# Altium schematic sheet WX0.007.002DL.SchDoc
size A2
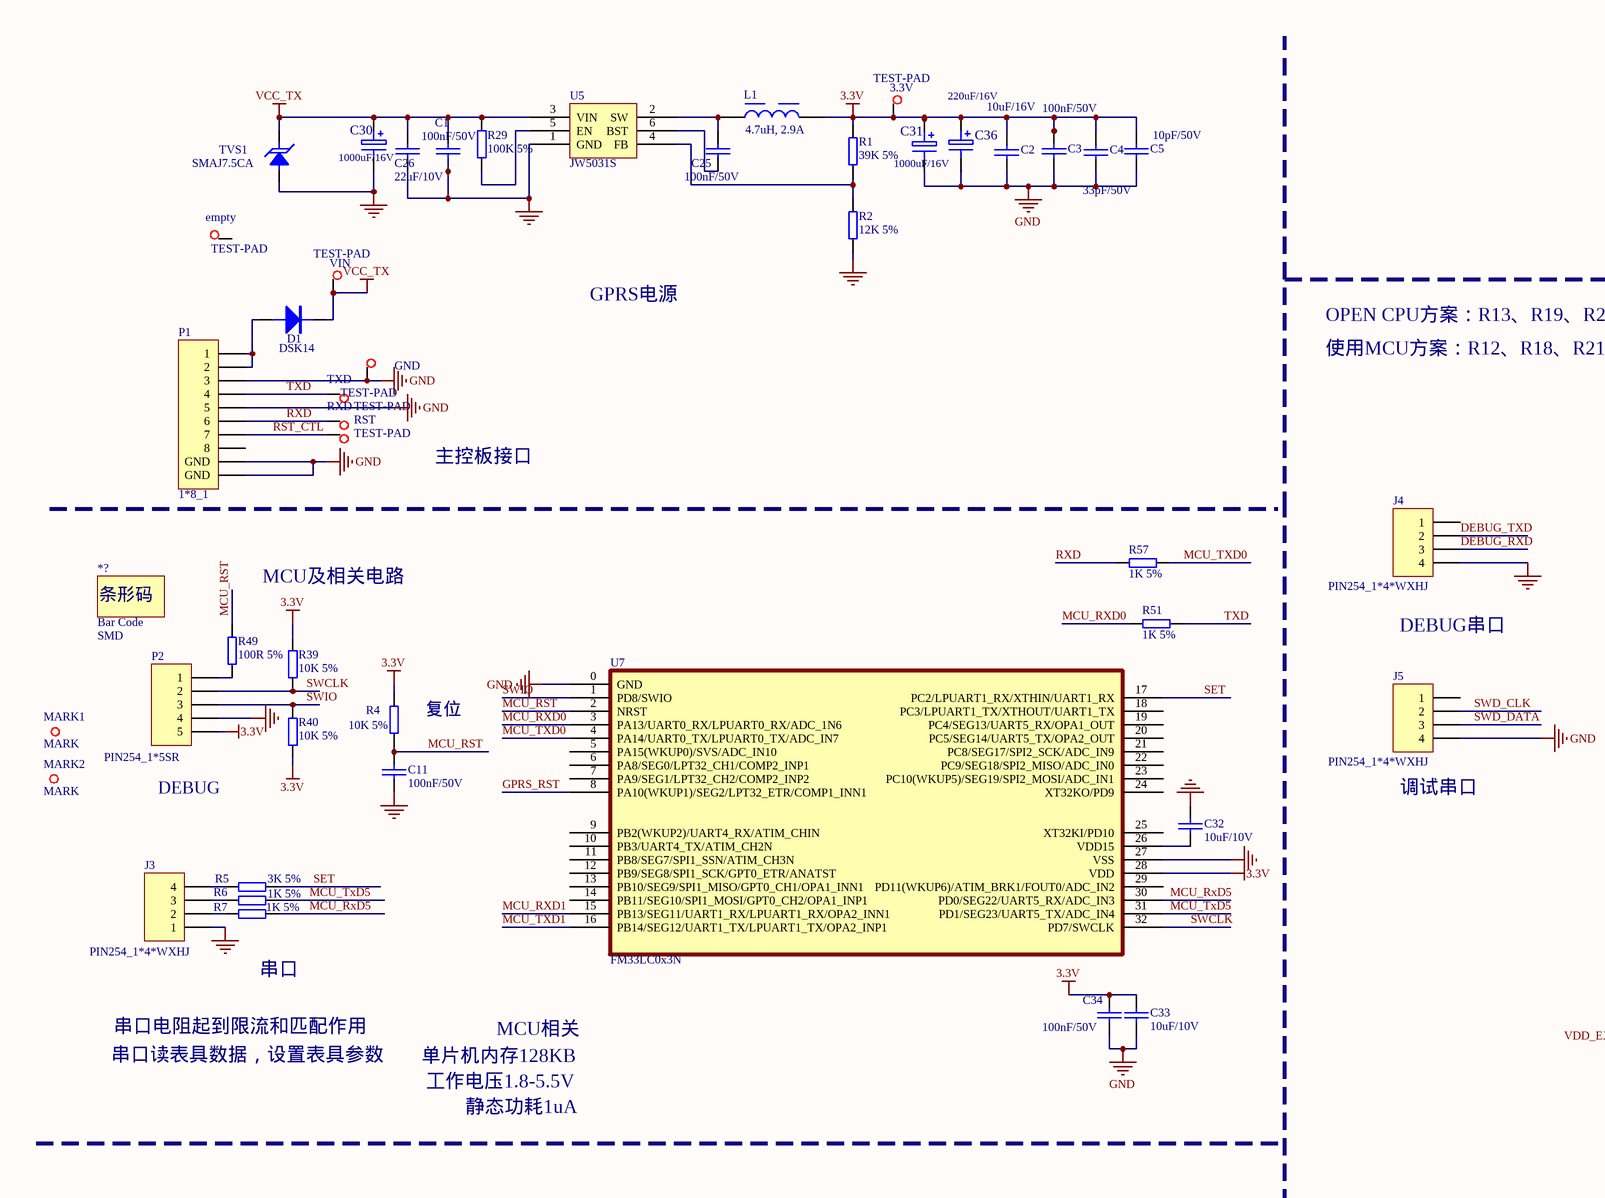
[diagram p0: WX0.007.002DL.SchDoc, left]
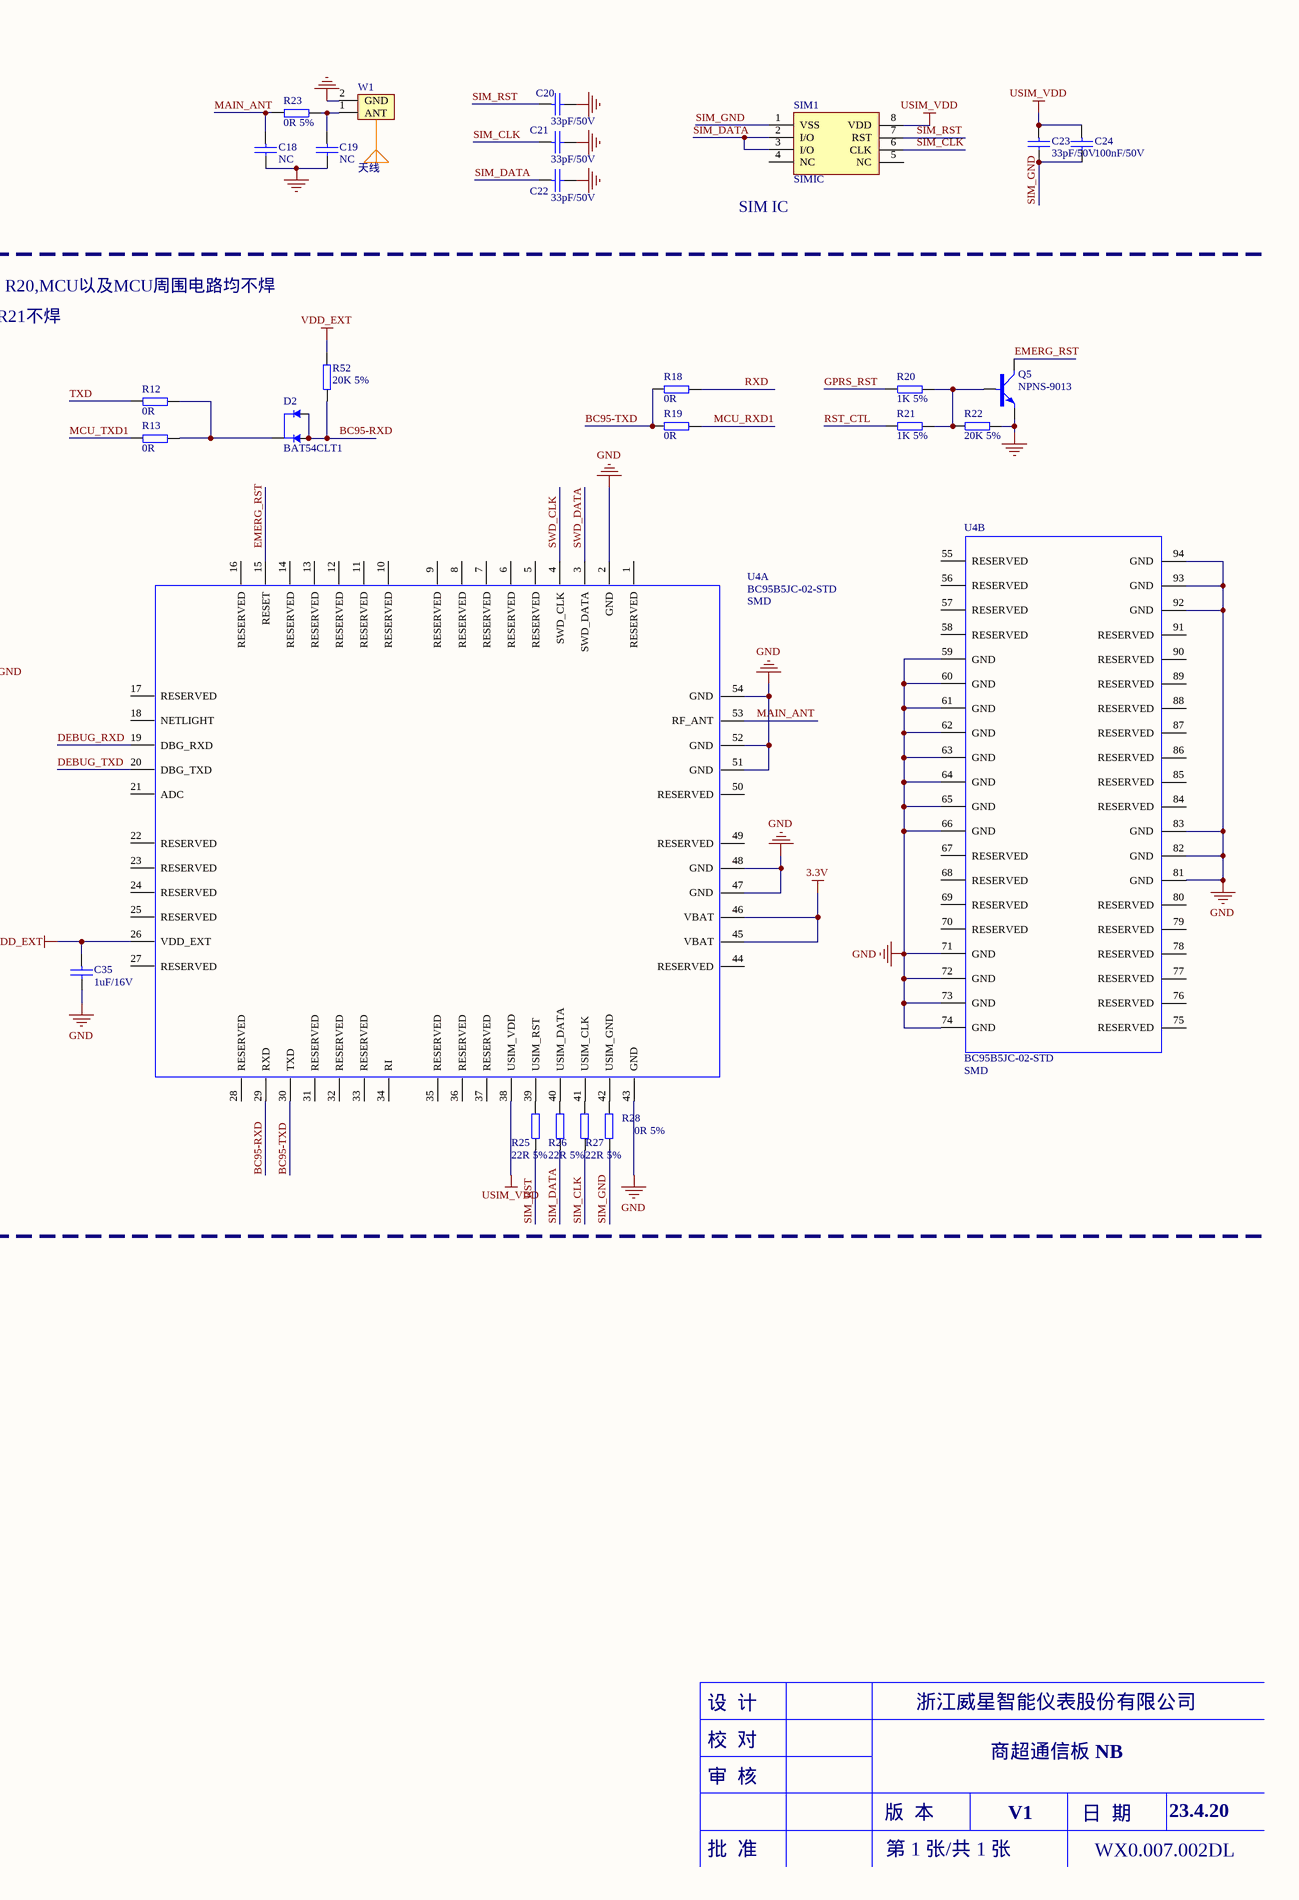
[diagram p1: WX0.007.002DL.SchDoc, right]

## Parts
3.3V  TEST-PAD  [TEST-PAD]
*?  Bar Code  SMD/DIP: SMD  [Bar Code1]
C1  100nF/50V  [CAP0603]
C2  10uF/16V  [CAP1206]
C3  100nF/50V  [CAP0603]
C4  33pF/50V  [CAP0603]
C5  10pF/50V  [CAP0603]
C11  100nF/50V  [CAP0603]
C18  NC  [CAP0603]
C19  NC  [CAP0603]
C20  33pF/50V  [CAP0603]
C21  33pF/50V  [CAP0603]
C22  33pF/50V  [CAP0603]
C23  33pF/50V  [CAP0603]
C24  100nF/50V  [CAP0603]
C25  100nF/50V  [CAP0603]
C26  22uF/10V  [CAP0805]
C30  1000uF/16V  [CAPSM_450_1000_1050]
C31  1000uF/16V  [CAPSM_450_1000_1050]
C32  10uF/10V  [CAP0603]
C33  10uF/10V  [CAP0603]
C34  100nF/50V  [CAP0603]
C35  1uF/16V  [CAP0603]
C36  220uF/16V  [220uf]
D1  DSK14  [SOD-123FL]
D2  BAT54CLT1  [SOT-23]
empty  TEST-PAD  [TEST-PAD]
GND  GND  [TEST-PAD]  (value not drawn)
J3  PIN254_1*4*WXHJ  [PIN254_1*4*1100S]
J4  PIN254_1*4*WXHJ  [PIN254_1*4*1100S]
J5  PIN254_1*4*WXHJ  [PIN254_1*4*1100S]
L1  4.7uH, 2.9A  [WE-MAPI_4020]
MARK1  MARK  [MARK]
MARK2  MARK  [MARK]
P1  1*8_1  [A2502AWR 1*8]
P2  PIN254_1*5SR  [PIN254_1*5SR]
Q5  NPNS-9013  [SOT-23]
R1  39K 5%  [RES0603]
R2  12K 5%  [RES0603]
R4  10K 5%  [RES0603]
R5  3K 5%  [RES0603]
R6  1K 5%  [RES0603]
R7  1K 5%  [RES0603]
R12  0R  [RES0603]
R13  0R  [RES0603]
R18  0R  [RES0603]
R19  0R  [RES0603]
R20  1K 5%  [RES0603]
R21  1K 5%  [RES0603]
R22  20K 5%  [RES0603]
R23  0R 5%  [RES0603]
R25  22R 5%  [RES0603]
R26  22R 5%  [RES0603]
R27  22R 5%  [RES0603]
R28  0R 5%  [RES0603]
R29  100K 5%  [RES0603]
R39  10K 5%  [RES0603]
R40  10K 5%  [RES0603]
R49  100R 5%  [RES0603]
R51  1K 5%  [RES0603]
R52  20K 5%  [RES0603]
R57  1K 5%  [RES0603]
RST  TEST-PAD  [TEST-PAD]
RXD  TEST-PAD  [TEST-PAD]
SIM1  SIMIC  [SIMIC]
TVS1  SMAJ7.5CA  [SMAJ7.5A]
TXD  TEST-PAD  [TEST-PAD]
U4  BC95B5JC-02-STD  SMD/DIP: SMD  [BC95B5JC-02-STD]  (parts A,B of 2)
U5  JW5031S  [PCBComponent_1 - duplicate1]
U7  FM33LC0x3N  [QFN32]
VIN  TEST-PAD  [TEST-PAD]
W1  天线  [ANT-IPEX]

## Nets
3.3V: 3.3V.1 C2.1 C3.1 C4.1 C5.1 C31.1 C33.1 C34.1 C36.1 L1.2 P2.5 R1.2 R4.2 R39.1 R40.1 U4.45(VBAT) U4.46(VBAT) U7.28(VDD)
GND: C1.1 C2.2 C3.2 C4.2 C5.2 C11.2 C18.2 C19.2 C20.2 C21.2 C22.2 C26.2 C30.2 C31.2 C32.1 C33.2 C34.2 C35.2 C36.2 GND.1 J3.1 J4.4 J5.4 P1.3 P1.5 P1.9(GND) P1.10(GND) P2.4 Q5.2(E) R2.1 R22.2 TVS1.2 U4.2(GND) U4.43(GND) U4.47(GND) U4.48(GND) U4.51(GND) U4.52(GND) U4.54(GND) U4.59(GND) U4.60(GND) U4.61(GND) U4.62(GND) U4.63(GND) U4.64(GND) U4.65(GND) U4.66(GND) U4.71(GND) U4.72(GND) U4.73(GND) U4.74(GND) U4.81(GND) U4.82(GND) U4.83(GND) U4.92(GND) U4.93(GND) U4.94(GND) U5.1(GND) U7.0(GND) U7.27(VSS) W1.2(GND)
USIM_VDD: C23.1 C24.1 SIM1.8(VDD) U4.38(USIM_VDD)
VCC_TX: C1.2 C26.1 C30.1 D1.2(K) R29.2 TVS1.1 U5.3(VIN) VIN.1
VDD_EXT: C35.1 R52.2 U4.26(VDD_EXT)
BC95-RXD: D2.1(A) D2.2(A) R52.1 U4.29(RXD)
BC95-TXD: R18.1 R19.1 U4.30(TXD)
DEBUG_RXD: J4.3 U4.19(DBG_RXD)
DEBUG_TXD: J4.2 U4.20(DBG_TXD)
EMERG_RST: Q5.3(C) U4.15(RESET)
GPRS_RST: R20.1 U7.8(PA10(WKUP1)/SEG2/LPT32_ETR/COMP1_INN1)
MAIN_ANT: C18.1 R23.1 U4.53(RF_ANT)
MCU_RST: C11.1 R4.1 R49.1 U7.2(NRST)
MCU_RXD0: R51.1 U7.3(PA13/UART0_RX/LPUART0_RX/ADC_1N6)
MCU_RXD1: R19.2 U7.15(PB13/SEG11/UART1_RX/LPUART1_RX/OPA2_INN1)
MCU_RxD5: R7.2 U7.30(PD0/SEG22/UART5_RX/ADC_IN3)
MCU_TXD0: R57.2 U7.4(PA14/UART0_TX/LPUART0_TX/ADC_IN7)
MCU_TXD1: R13.1 U7.16(PB14/SEG12/UART1_TX/LPUART1_TX/OPA2_INP1)
MCU_TxD5: R6.2 U7.31(PD1/SEG23/UART5_TX/ADC_IN4)
RST_CTL: P1.7 R21.1 RST.1
RXD: P1.6 R18.2 R57.1 RXD.1
SET: R5.2 U7.17(PC2/LPUART1_RX/XTHIN/UART1_RX)
SIM_CLK: C21.1 R27.1 SIM1.6(CLK)
SIM_DATA: C22.1 R26.1 SIM1.2(I/O) SIM1.3(I/O)
SIM_GND: C23.2 C24.2 R28.1 SIM1.1(VSS)
SIM_RST: C20.1 R25.1 SIM1.7(RST)
SWCLK: P2.2 R39.2 U7.32(PD7/SWCLK)
SWD_CLK: J5.2 U4.4(SWD_CLK)
SWD_DATA: J5.3 U4.3(SWD_DATA)
SWIO: P2.3 R40.2 U7.1(PD8/SWIO)
TXD: P1.4 R12.1 R51.2 TXD.1
NetC19_1: C19.1 R23.2 W1.1(ANT)
NetC25_1: C25.1 L1.1 U5.2(SW)
NetC25_2: C25.2 U5.6(BST)
NetC32_2: C32.2 U7.26(VDD15)
NetD1_1: D1.1(A) P1.1 P1.2
NetD2_3: D2.3(C) R12.2 R13.2
NetJ3_2: J3.2 R7.1
NetJ3_3: J3.3 R6.1
NetJ3_4: J3.4 R5.1
NetP2_1: P2.1 R49.2
NetQ5_1: Q5.1(B) R20.2 R21.2 R22.1
NetR1_1: R1.1 R2.2 U5.4(FB)
NetR25_2: R25.2 U4.39(USIM_RST)
NetR26_2: R26.2 U4.40(USIM_DATA)
NetR27_2: R27.2 U4.41(USIM_CLK)
NetR28_2: R28.2 U4.42(USIM_GND)
NetR29_1: R29.1 U5.5(EN)

Not connected (* = marked no-connect by the designer): empty 1; J4 1; J5 1; P1 8; SIM1 4(NC) 5(NC); U4 1(RESERVED) 5(RESERVED) 6(RESERVED) 7(RESERVED) 8(RESERVED) 9(RESERVED) 10(RESERVED) 11(RESERVED) 12(RESERVED) 13(RESERVED) 14(RESERVED) 16(RESERVED) 17(RESERVED) 18(NETLIGHT) 21(ADC) 22(RESERVED) 23(RESERVED) 24(RESERVED) 25(RESERVED) 27(RESERVED) 28(RESERVED) 31(RESERVED) 32(RESERVED) 33(RESERVED) 34(RI) 35(RESERVED) 36(RESERVED) 37(RESERVED) 44(RESERVED) 49(RESERVED) 50(RESERVED) 55(RESERVED) 56(RESERVED) 57(RESERVED) 58(RESERVED) 67(RESERVED) 68(RESERVED) 69(RESERVED) 70(RESERVED) 75(RESERVED) 76(RESERVED) 77(RESERVED) 78(RESERVED) 79(RESERVED) 80(RESERVED) 84(RESERVED) 85(RESERVED) 86(RESERVED) 87(RESERVED) 88(RESERVED) 89(RESERVED) 90(RESERVED) 91(RESERVED); U7 5(PA15(WKUP0)/SVS/ADC_IN10) 6(PA8/SEG0/LPT32_CH1/COMP2_INP1) 7(PA9/SEG1/LPT32_CH2/COMP2_INP2) 9(PB2(WKUP2)/UART4_RX/ATIM_CHIN) 10(PB3/UART4_TX/ATIM_CH2N) 11(PB8/SEG7/SPI1_SSN/ATIM_CH3N) 12(PB9/SEG8/SPI1_SCK/GPT0_ETR/ANATST) 13(PB10/SEG9/SPI1_MISO/GPT0_CH1/OPA1_INN1) 14(PB11/SEG10/SPI1_MOSI/GPT0_CH2/OPA1_INP1) 18(PC3/LPUART1_TX/XTHOUT/UART1_TX) 19(PC4/SEG13/UART5_RX/OPA1_OUT) 20(PC5/SEG14/UART5_TX/OPA2_OUT) 21(PC8/SEG17/SPI2_SCK/ADC_IN9) 22(PC9/SEG18/SPI2_MISO/ADC_IN0) 23(PC10(WKUP5)/SEG19/SPI2_MOSI/ADC_IN1) 24(XT32KO/PD9) 25(XT32KI/PD10) 29(PD11(WKUP6)/ATIM_BRK1/FOUT0/ADC_IN2)

## Notes on the sheet
- (near SIM1) SIM IC
- GPRS电源
- OPEN CPU方案：R13、R19、R20,MCU以及MCU周围电路均不焊
- 使用MCU方案：R12、R18、R21不焊
- 主控板接口
- MCU及相关电路
- DEBUG串口
- (near R4) 复位
- (near P2) DEBUG
- (near J5) 调试串口
- 串口
- 串口电阻起到限流和匹配作用
- 单片机内存128KB
- MCU相关
- 串口读表具数据，设置表具参数
- 工作电压1.8-5.5V
- 静态功耗1uA
- 设  计
- 校  对
- 浙江威星智能仪表股份有限公司
- 审  核
- 商超通信板 NB
- 批  准
- 版  本
- 第 1 张/共 1 张
- V1
- 日  期
- WX0.007.002DL
- 23.4.20

## Library data of the parts
3.3V empty GND RST RXD TXD VIN = AD_WXHJ_TEST-PAD_01: 单面焊盘测试点; Part Name: 测试点; ID: 23; SMD/DIP: SMD; Part Number: AD_WXHJ_TEST-PAD_01
*? = AD_WXHJ_Bar Code_01: 条形码 无需焊接器件; ID: 12; Part Number: AD_WXHJ_Bar Code_01; Part Name: 条形码
C1 C3 C11 C24 C25 C34 = 101020103-0021: 104pF,50 V,±10%,0603,国巨,CC0603KRX7R9BB104; Part Name: 0603贴片电容; ID: 3; SMD/DIP: SMD; Part Number: 101020103-0021
C2 = 101020101-0005: 106P,16 V,±10%,1206,国巨,CC1206KRNPO7BN106P; Part Name: 1206贴片电容; ID: 9; SMD/DIP: SMD; Part Number: 101020101-0005
C4 C20-C23 = 101020103-0027: 33pF,50 V,±10%,0603,国巨,CC0603KRNPO9BN33; Part Name: 0603贴片电容; ID: 17; SMD/DIP: SMD; Part Number: 101020103-0027
C5 = 101020103-0014: 10pF,50 V,±5%,0603,X7R,国巨,CC0603JRNPO9BN100; Part Name: 0603贴片电容; ID: 7; SMD/DIP: SMD; Part Number: 101020103-0014
C18 C19 = CAP: 无极性电容
C26 = 101020102-0012: 226P,10 V,±20%,0805,村田电子有限公司,GRM21BR61A226ME51L; Part Name: 贴片电容; ID: 20; SMD/DIP: SMD; Part Number: 101020102-0012
C30 C31 C36 = CAP-POL1: 电解电容
C32 C33 = 101020103-0026: 106pF,10 V,±10%,0603,村田,GRM188R61A106KE47D; Part Name: 0603贴片电容; ID: 8; SMD/DIP: SMD; Part Number: 101020103-0026
C35 = 101020103-0003: 105pF,16 V,±10%,0603,国巨,CC0603KRX7R7BB105; Part Name: 0603贴片电容; ID: 14; SMD/DIP: SMD; Part Number: 101020103-0003
D1 = DIODE: 二极管，Diode
D2 = 101040101-0038: BAT54CLT1，SOT23-3,SOT23-3,0.2 A,0.8 V,30 V,安森美,BAT54CLT1; Part Name: 贴片肖特基; ID: 8; SMD/DIP: SMD; Part Number: 101040101-0038
J3-J5 = AD_WXHJ_PinHeader_01: 1*4 ，Φ1.0 ，2.54mm，直脚,无需焊接器件; Part Name: 排针; ID: 16; SMD/DIP: DIP; Part Number: AD_WXHJ_PinHeader_01
L1 = 74438356047: WE-MAPI SMT Power Inductor, size 4020, 4.7uH, 2.9A; Manufacturer: Wurth Elektronik; DC Resistance typ.: 63mOhm; DC Resistance max.: 76mOhm; Self Resonant Frequency: 22MHz; Saturation Current: 4.7A; ComponentLink1Description: Manufacturer; ComponentLink1URL: http://www.we-online.de; ComponentLink2Description: Datasheet; ComponentLink2URL: https://www.we-online.com/catalog/datasheet/74438356047.pdf; Mounting Technology: SMT; Operating Temperature: -40 to +125degC; Packaging: Tape and Reel; Published Date: December 2020; Size: 4020; Inductance: 4.7uH; Manufacturer Part Number: 74438356047; Rated Current: 2.9A
MARK1 MARK2 = AD_WXHJ_MARK_01: MARK点; ID: 8; SMD/DIP: SMD; Part Number: AD_WXHJ_MARK_01; Part Name: MARK点
P2 = 101090302-0002: 1*40 ，Φ1.0 ，2.54mm，弯脚,2.54 mm,单排,插件; Part Name: 排针; ID: 18; SMD/DIP: DIP; Part Number: 101090302-0002
Q5 = 101040201-0002: 9013,NPN,SOT-23,长电,S9013; Part Name: 贴片三极管; ID: 15; SMD/DIP: SMD; Part Number: 101040201-0002
R1 = 101010103-0064: 国巨,±5%,0603,,155 ℃,-55 ℃,RC0603JR-0739KL,无铅,100 ppm/℃,1/10W,,39K; Part Name: 0603贴片电阻; ID: 32; SMD/DIP: SMD; Part Number: 101010103-0064
R2 = 101010103-0046: 国巨,±5%,0603,,155 ℃,-55 ℃,RC0603JR-0712KL,含铅,100 ppm/℃,1/10W,,12K; Part Name: 0603贴片电阻; ID: 9; SMD/DIP: SMD; Part Number: 101010103-0046
R4 = 101010103-0003: 国巨,±5%,0603,,155 ℃,-55 ℃,RC0603JR-0710KL,无铅,200 ppm/℃,1/10W,,10K; Part Name: 0603贴片电阻; ID: 7; SMD/DIP: SMD; Part Number: 101010103-0003
R5 = 101010103-0006: 国巨,±5%,0603,,155 ℃,-55 ℃,RC0603JR-073KL,无铅,100 ppm/℃,1/10W,,3K; Part Name: 0603贴片电阻; ID: 22; SMD/DIP: SMD; Part Number: 101010103-0006
R6 R7 = 101010103-0008: 1K,±5%,1/10W,0603,国巨,RC0603JR-071KL; Part Name: 0603贴片电阻; ID: 9; SMD/DIP: SMD; Part Number: 101010103-0008
R12 R13 R18-R21 R51 R57 = 101010103-0006: 国巨,±5%,0603,,155 ℃,-55 ℃,RC0603JR-073KL,无铅,100 ppm/℃,1/10W,,3K; Part Name: 0603贴片电阻; ID: 23; SMD/DIP: SMD; Part Number: 101010103-0006
R22 R52 = 101010103-0004: 国巨,±5%,0603,,155 ℃,-55 ℃,RC0603JR-0720KL,无铅,200 ppm/℃,1/10W,,20K; Part Name: 0603贴片电阻; ID: 15; SMD/DIP: SMD; Part Number: 101010103-0004
R23 R28 = 101010103-0001: 国巨,±5%,0603,,155 ℃,-55 ℃,RC0603J2-070RL,无铅,200 ppm/℃,1/10W,,0R; Part Name: 0603贴片电阻; ID: 1; SMD/DIP: SMD; Part Number: 101010103-0001
R25-R27 = 101010103-0009: 国巨,±5%,0603,,155 ℃,-55 ℃,RC0603JR-0722RL,无铅,200 ppm/℃,1/10W,,22欧; Part Name: 0603贴片电阻; ID: 17; SMD/DIP: SMD; Part Number: 101010103-0009
R29 = 101010103-0005: 国巨,±5%,0603,,155 ℃,-55 ℃,RC0603JR-07100KL,无铅,100 ppm/℃,1/10W,,100K; Part Name: 0603贴片电阻; ID: 3; SMD/DIP: SMD; Part Number: 101010103-0005
R39 R40 = 101010103-0003: 国巨,±5%,0603,,155 ℃,-55 ℃,RC0603JR-0710KL,无铅,200 ppm/℃,1/10W,,10K; Part Name: 0603贴片电阻; ID: 5; SMD/DIP: SMD; Part Number: 101010103-0003
R49 = 101010103-0022: 100R,±5%,1/10W,0603,国巨,RC0603JR-07100RL; Part Name: 0603贴片电阻; ID: 4; SMD/DIP: SMD; Part Number: 101010103-0022
SIM1 = AD_XN_SIMIC_01: SIMIC虚拟器件; ID: 21; SMD/DIP: SMD; Part Number: AD_XN_SIMIC_01; Part Name: SIMIC
U4 = 1011402-0141: BC95-B5,23.6mm*19.9mm*2.2mm,BC95B5JC-02-STD,LCC贴片封装,上海移远通信技术股份; Part Name: NB-IOT模块; ID: 15; Value: *; Part Description: *; PCB DECAL: *; Part Number: 1011402-0141
U5 = Component_3
W1 = Antenna2: 天线，带屏蔽